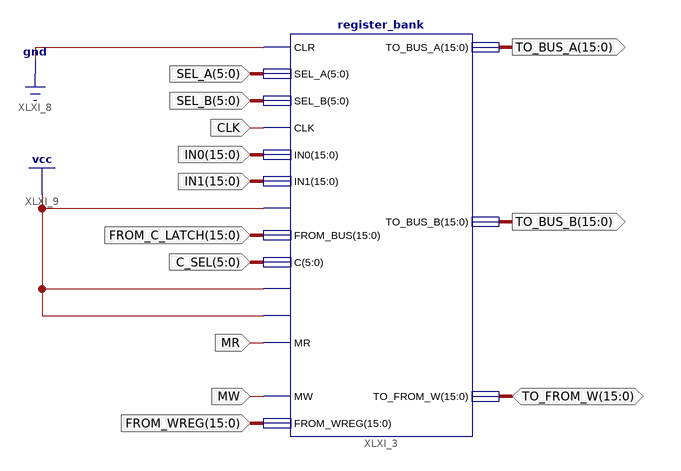
[diagram p0: schematic sheet 1]
// Xilinx ISE schematic register_bank_easy.sch (artix7) as structural Verilog: 1 symbols, 13 ports
module register_bank_easy (
  input  [5:0] SEL_A,
  input  [5:0] SEL_B,
  input  [15:0] FROM_WREG,
  input  [5:0] C_SEL,
  input  CLK,
  input  [15:0] IN0,
  input  [15:0] IN1,
  input  [15:0] FROM_C_LATCH,
  input  MR,
  input  MW,
  inout  [15:0] TO_FROM_W,
  output [15:0] TO_BUS_A,
  output [15:0] TO_BUS_B
);

  register_bank XLXI_3 (
    .CLR(1'b0), .SEL_A(SEL_A), .SEL_B(SEL_B), .CLK(CLK), .IN0(IN0), .IN1(IN1), .CE_DIN(1'b1),
    .FROM_BUS(FROM_C_LATCH), .C(C_SEL), .ENABLE_DEMUX_C(1'b1), .INPUT_DEMUX(1'b1), .MR(MR), .MW(MW),
    .TO_FROM_W(TO_FROM_W), .TO_BUS_A(TO_BUS_A), .TO_BUS_B(TO_BUS_B), .FROM_WREG(FROM_WREG));
endmodule
